# EAGLE schematic MCU_RTC_DIAGRAM_REV_2.0 (EAGLE 7.1.0)
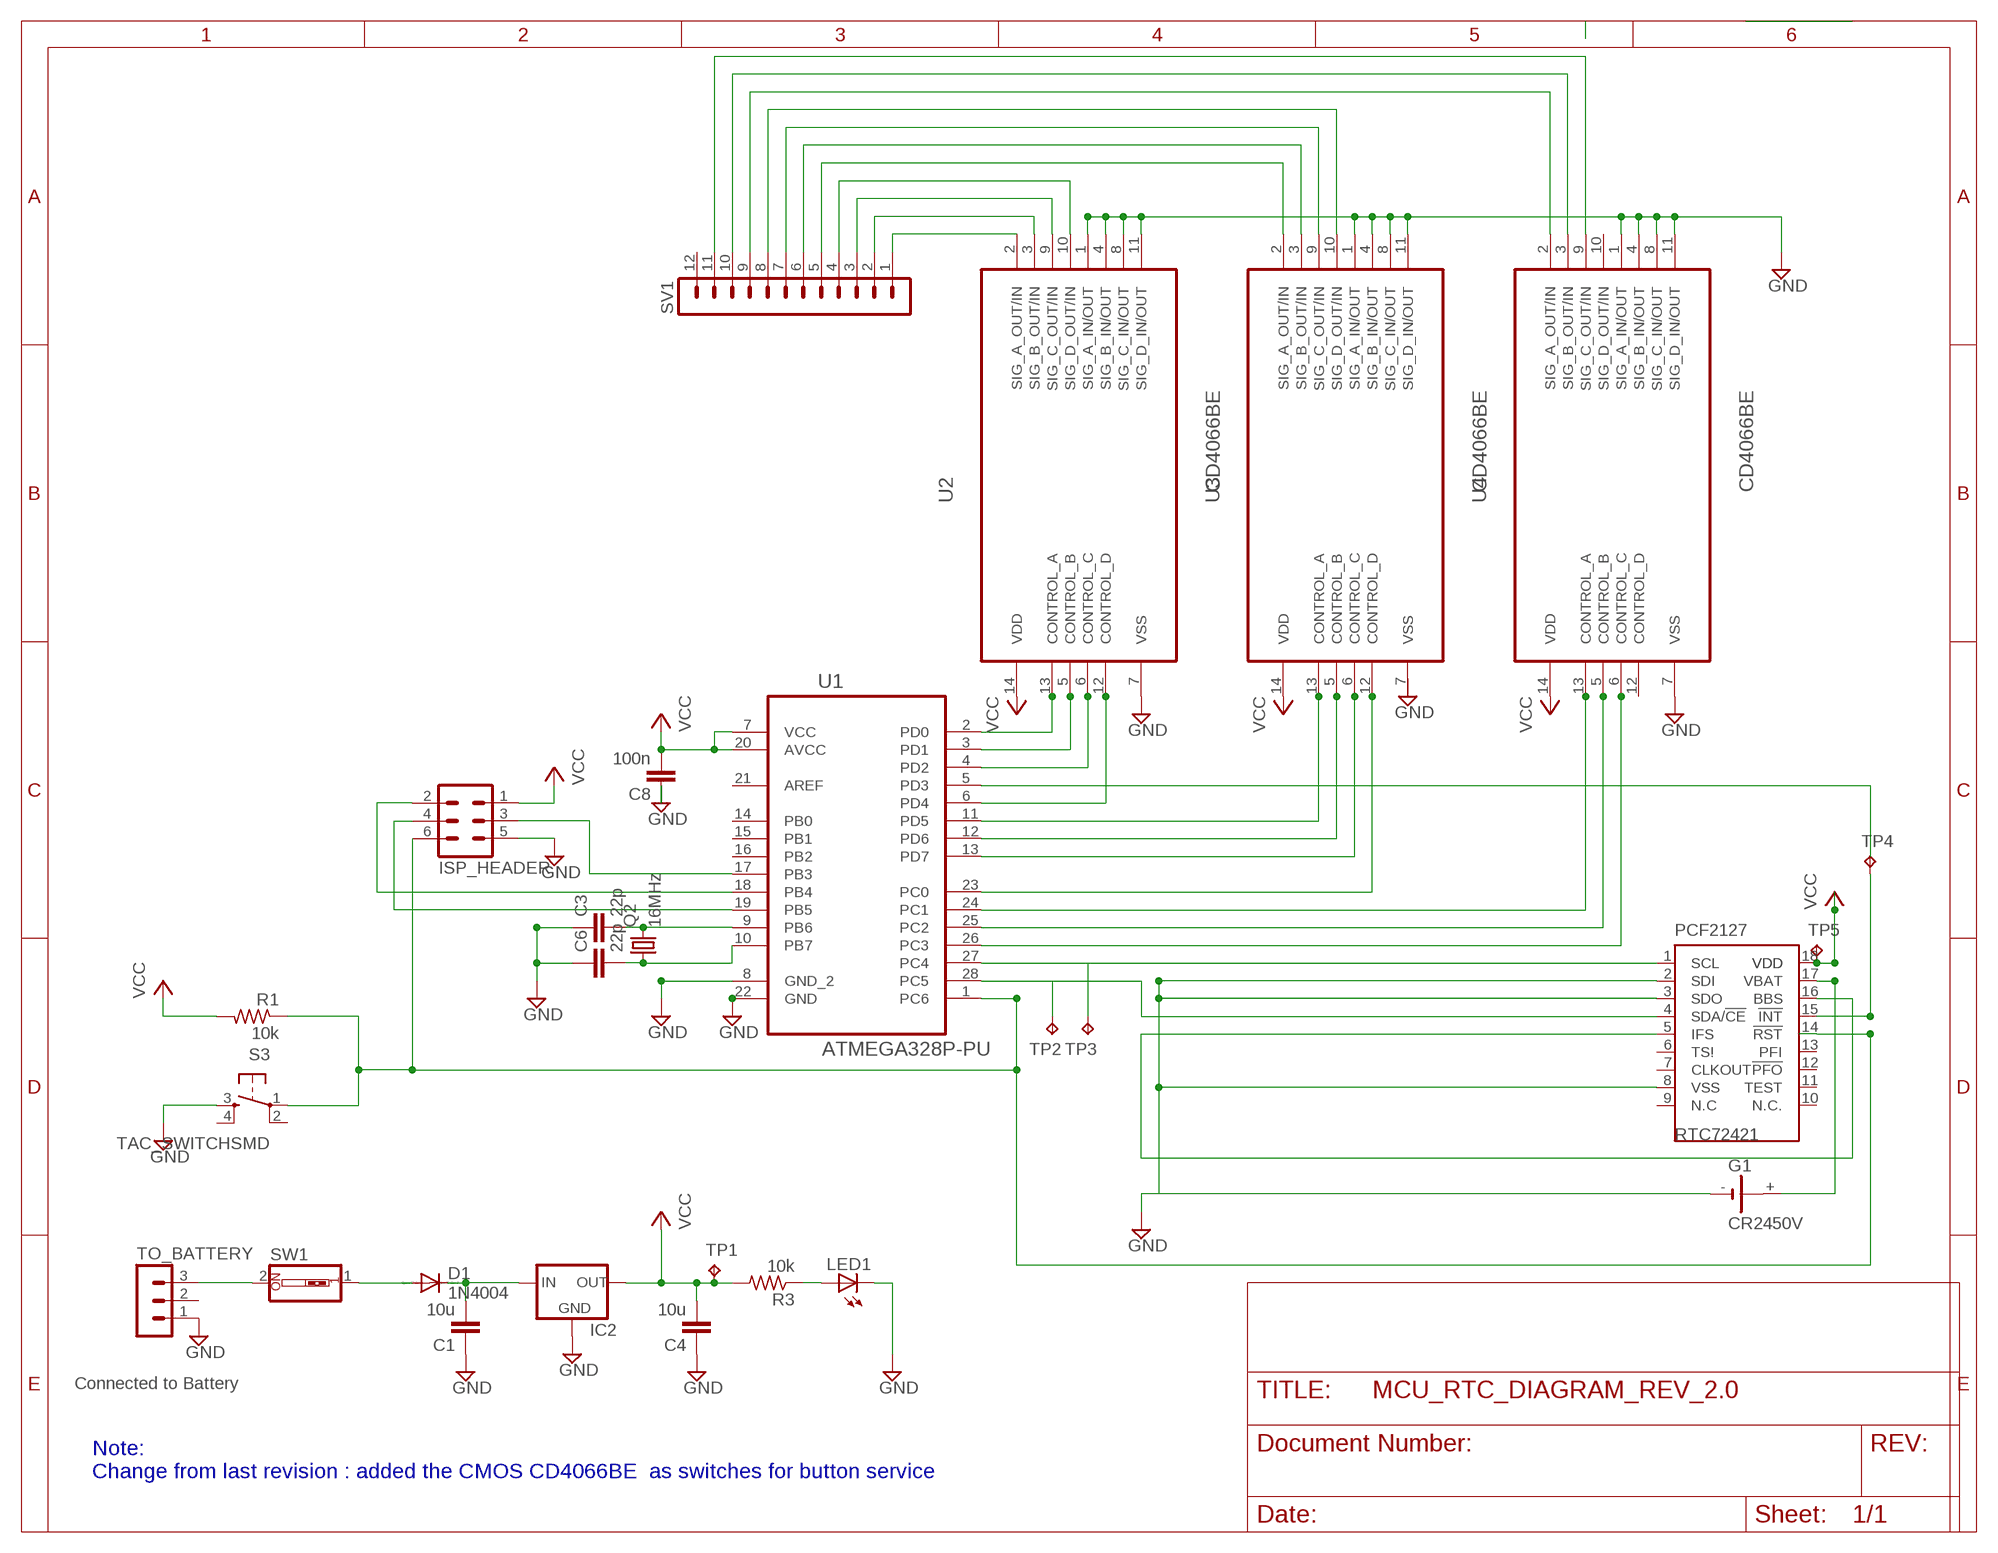
[diagram p0: schematic, sheet 1]

## Parts
C1  10u  C-EUC0805  [C0805]
C3  22p  C-EUC0805  [C0805]
C4  10u  C-EUC0805  [C0805]
C6  22p  C-EUC0805  [C0805]
C8  100n  C-EUC0805  [C0805]
D1  1N4004  [DO41-10]
G1  CR2450V  [CR2450V]
IC1  RTC72421  [DIL18]
IC2  78XXL  [78XXL]
ISP_HEADER  MA03-2  [MA03-2]
LED1  LEDCHIPLED_0805  [CHIPLED_0805]
Q2  16MHz  CRYSTALHC49S  [HC49/S]
R1  10k  R-US_R0805  [R0805]
R3  10k  R-US_R0805  [R0805]
S3  TAC_SWITCHSMD  [TACTILE-SWITCH-SMD]
SV1  MA12-1W  [MA12-1W]
SW1  SW_DIP-1  [EDG-01]
TO_BATTERY  MA03-1  [MA03-1]
TP1  TPB1,27  [B1,27]
TP2  TPB1,27  [B1,27]
TP3  TPB1,27  [B1,27]
TP4  TPB1,27  [B1,27]
TP5  TPB1,27  [B1,27]
U1  ATMEGA328P-PU  [DIP254P762X457-28]
U2  CD4066BE  [DIP254P762X508-14]
U3  CD4066BE  [DIP254P762X508-14]
U4  CD4066BE  [DIP254P762X508-14]

## Nets
GND: C1.1 C3.1 C4.1 C6.1 C8.1 G1.- IC1.2(SDI) IC1.3(SDO) IC1.8(VSS) IC2.GND ISP_HEADER.5 LED1.C S3.3 TO_BATTERY.1 U1.8(GND_2) U1.22(GND) U2.1(SIG_A_IN/OUT) U2.4(SIG_B_IN/OUT) U2.7(VSS) U2.8(SIG_C_IN/OUT) U2.11(SIG_D_IN/OUT) U3.1(SIG_A_IN/OUT) U3.4(SIG_B_IN/OUT) U3.8(SIG_C_IN/OUT) U3.11(SIG_D_IN/OUT) U4.1(SIG_A_IN/OUT) U4.4(SIG_B_IN/OUT) U4.7(VSS) U4.8(SIG_C_IN/OUT) U4.11(SIG_D_IN/OUT)
MISO: ISP_HEADER.2 U1.18(PB4)
MOSI: ISP_HEADER.3 U1.17(PB3)
N$2: LED1.A R3.1
N$3: D1.A SW1.1
N$4: U1.5(PD3)
N$5: C1.2 D1.C IC2.IN
N$6: IC1.15(!INT) TP4.TP
N$7: IC1.1(SCL) TP3.TP U1.27(PC4)
N$8: C3.2 Q2.2 U1.9(PB6)
N$9: U1.2(PD0) U2.13(CONTROL_A)
N$10: C6.2 Q2.1 U1.10(PB7)
N$12: SV1.8 U3.10(SIG_D_OUT/IN)
N$13: U1.3(PD1) U2.5(CONTROL_B)
N$14: IC1.4(SDA/!CE) TP2.TP U1.28(PC5)
N$15: G1.+ IC1.17(VBAT)
N$16: U1.4(PD2) U2.6(CONTROL_C)
N$17: U1.6(PD4) U2.12(CONTROL_D)
N$18: U1.11(PD5) U3.13(CONTROL_A)
N$19: U1.12(PD6) U3.5(CONTROL_B)
N$20: SW1.2 TO_BATTERY.3
N$21: IC1.5(IFS) IC1.16(VCC)
N$22: U1.13(PD7) U3.6(CONTROL_C)
N$23: U1.23(PC0) U3.12(CONTROL_D)
N$24: U1.24(PC1) U4.13(CONTROL_A)
N$25: U1.25(PC2) U4.5(CONTROL_B)
N$26: U1.26(PC3) U4.6(CONTROL_C)
N$27: SV1.1 U2.2(SIG_A_OUT/IN)
N$28: SV1.2 U2.3(SIG_B_OUT/IN)
N$29: SV1.3 U2.9(SIG_C_OUT/IN)
N$30: SV1.4 U2.10(SIG_D_OUT/IN)
N$31: SV1.5 U3.2(SIG_A_OUT/IN)
N$32: SV1.6 U3.3(SIG_B_OUT/IN)
N$33: SV1.7 U3.9(SIG_C_OUT/IN)
N$34: SV1.9 U4.2(SIG_A_OUT/IN)
N$35: SV1.10 U4.3(SIG_B_OUT/IN)
N$36: SV1.11 U4.9(SIG_C_OUT/IN)
RESET: IC1.14(!RST) ISP_HEADER.6 R1.1 S3.1 U1.1(PC6)
SCK: ISP_HEADER.4 U1.19(PB5)
VCC: C4.2 C8.2 IC1.18(VDD) IC2.OUT ISP_HEADER.1 R1.2 R3.2 TP1.TP TP5.TP U1.7(VCC) U1.20(AVCC) U2.14(VDD) U3.14(VDD) U4.14(VDD)
Unconnected: G1.+@1(+) IC1.6(TS!) IC1.7(CLKOUT) IC1.9(N.C) IC1.10(N.C.) IC1.11(TEST) IC1.12(!PFO) IC1.13(PFI) S3.2 S3.4 SV1.12 TO_BATTERY.2 U1.14(PB0) U1.15(PB1) U1.16(PB2) U1.21(AREF) U3.7(VSS) U4.10(SIG_D_OUT/IN) U4.12(CONTROL_D)

## Notes on the sheet
- Connected to Battery
- Note: 
  Change from last revision : added the CMOS CD4066BE  as switches for button service

## Library data of the parts
C1 C3 C4 C6 C8 = rcl:C-EU: CAPACITOR, European symbol
D1 = diode:1N4004: DIODE general purpose rectifier, 1 A
G1 = battery:CR2450V: LI BATTERY Varta
IC1 = pcf2127:RTC72421: Real Time Clock http://www.foxonline.com/72421.htm; MPN: RTC72421B; OC_FARNELL: 1216228; OC_NEWARK: 01M8738
IC2 = v-reg:78XXL: VOLTAGE REGULATOR
ISP_HEADER = con-lstb:MA03-2: PIN HEADER; OC_FARNELL: unknown; OC_NEWARK: unknown
LED1 = led:LED: LED OSRAM: - CHIPLED LG R971, LG N971, LY N971, LG Q971, LY Q971, LO R971, LY R971 LH N974, LH R974 LS Q976, LO Q976, LY Q976 LO Q996 - Hyper CHIPLED LW Q18S LB Q993, LB Q99A, LB R99A - SideLED LS A670, LO A670, LY A670, LG A670, LP A670 LB A673, LV A673, LT A673, LW A673 LH A674 LY A675 LS A676, LA A676, LO A676, LY A676, LW A676 LS A679, LY A679, LG A679 - Hyper Micro SIDELED® LS Y876, LA Y876, LO Y876, LY Y876 LT Y87S - SmartLED LW L88C, LW L88S LB L89C, LB L89S, LG L890 LS L89K, LO L89K, LY L89K LS L896, LA L896, LO L896, LY L896 - TOPLED LS T670, LO T670, LY T670, LG T670, LP T670 LSG T670, LSP T670, LSY T670, LOP T670, LYG T670 LG T671, LOG T671, LSG T671 LB T673, LV T673, LT T673, LW T673 LH T674 LS T676, LA T676, LO T676, LY T676, LB T676, LH T676, LSB T676, LW T676 LB T67C, LV T67C, LT T67C, LS T67K, LO T67K, LY T67K, LW E67C LS E67B, LA E67B, LO E67B, LY E67B, LB E67C, LV E67C, LT E67C LW T67C LS T679, LY T679, LG T679 LS T770, LO T770, LY T770, LG T770, LP T770 LB T773, LV T773, LT T773, LW T773 LH T774 LS E675, LA E675, LY E675, LS T675 LS T776, LA T776, LO T776, LY T776, LB T776 LHGB T686 LT T68C, LB T68C - Hyper Mini TOPLED® LB M676 - Mini TOPLED Santana® LG M470 LS M47K, LO M47K, LY M47K Source: http://www.osram.convergy.de LUXEON: - LUMILED® LXK2-PW12-R00, LXK2-PW12-S00, LXK2-PW14-U00, LXK2-PW14-V00 LXK2-PM12-R00, LXK2-PM12-S00, LXK2-PM14-U00 LXK2-PE12-Q00, LXK2-PE12-R00, LXK2-PE12-S00, LXK2-PE14-T00, LXK2-PE14-U00 LXK2-PB12-K00, LXK2-PB12-L00, LXK2-PB12-M00, LXK2-PB14-N00, LXK2-PB14-P00, LXK2-PB14-Q00 LXK2-PR12-L00, LXK2-PR12-M00, LXK2-PR14-Q00, LXK2-PR14-R00 LXK2-PD12-Q00, LXK2-PD12-R00, LXK2-PD12-S00 LXK2-PH12-R00, LXK2-PH12-S00 LXK2-PL12-P00, LXK2-PL12-Q00, LXK2-PL12-R00 Source: www.luxeon.com KINGBRIGHT: KA-3528ASYC Source: www.kingbright.com
Q2 = crystal:CRYSTAL: CRYSTAL; OC_FARNELL: 1667008; OC_NEWARK: unknown
R1 R3 = rcl:R-US_: RESISTOR, American symbol
S3 = SparkFun-Electromechanical:TAC_SWITCH: Momentary Switch Button commonly used for reset or general input. Spark Fun Electronics SKU : COM-00097 SMT- SWCH-08247; PROD_ID: SWCH-08247
SV1 = con-lstb:MA12-1W: PIN HEADER; OC_FARNELL: unknown; OC_NEWARK: unknown
SW1 = special:SW_DIP-1: DIP SWITCH
TO_BATTERY = con-lstb:MA03-1: PIN HEADER; OC_FARNELL: unknown; OC_NEWARK: unknown
TP1-TP5 = testpad:TP: Test pad
U1 = Atmel_By_element14_Batch_1-00:ATMEGA328P-PU: 8-bit Microcontroller with In-System Programmable Flash; MPN: ATMEGA328P-PU; OC_FARNELL: 1715487; OC_NEWARK: 15R0268; PACKAGE: PDIP-28; SUPPLIER: Atmel
U2-U4 = Texas Instruments_By_element14_Batch_1:CD4066BE: CMOS Quad Bilateral Switch; MPN: CD4066BE; OC_FARNELL: 1106112; OC_NEWARK: 60K5124; PACKAGE: PDIP-14; SUPPLIER: Texas Instruments